# EAGLE schematic CHIRIMENBasicShield (EAGLE 7.5.0)
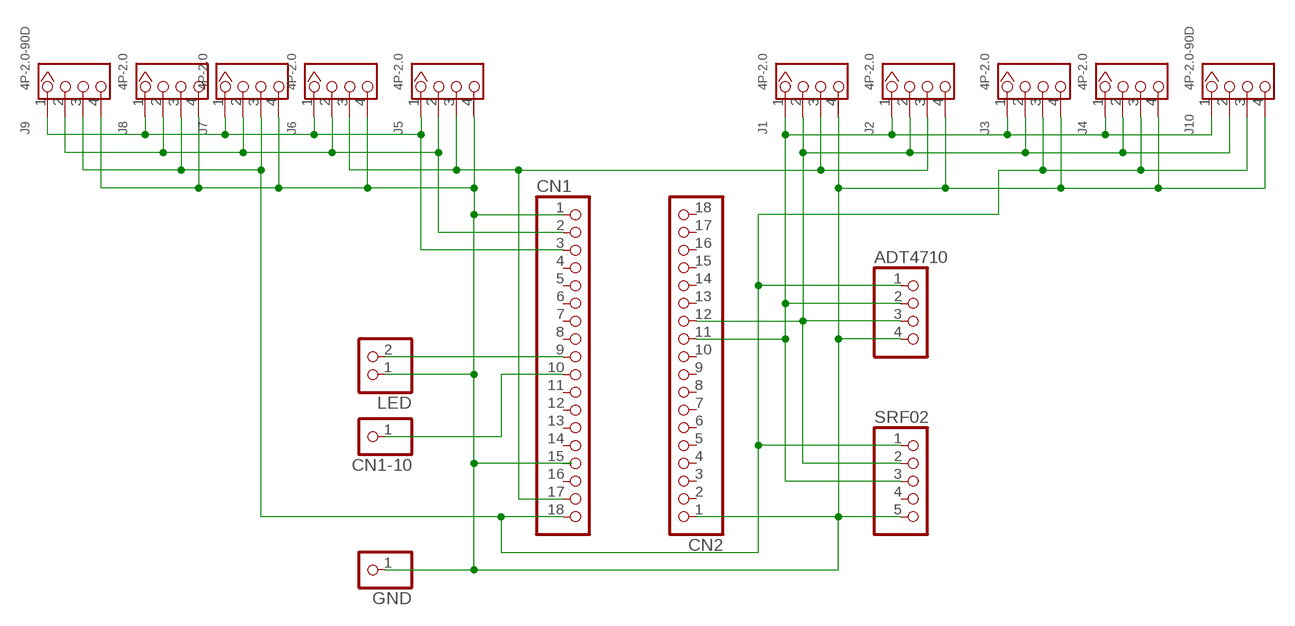
[diagram p0: schematic, sheet 1]

## Parts
ADT4710  PINHD-1X4  [1X04]
CN1  PINHD-1X18  [1X18]
CN1-10  PINHD-1X1  [1X01]
CN2  PINHD-1X18  [1X18]
GND  PINHD-1X1  [1X01]
J1  4P-2.0  GROVE-CONNECTOR-DIP(4P-2.0)  [HW4-2.0]
J2  4P-2.0  GROVE-CONNECTOR-DIP(4P-2.0)  [HW4-2.0]
J3  4P-2.0  GROVE-CONNECTOR-DIP(4P-2.0)  [HW4-2.0]
J4  4P-2.0  GROVE-CONNECTOR-DIP(4P-2.0)  [HW4-2.0]
J5  4P-2.0  GROVE-CONNECTOR-DIP(4P-2.0)  [HW4-2.0]
J6  4P-2.0  GROVE-CONNECTOR-DIP(4P-2.0)  [HW4-2.0]
J7  4P-2.0  GROVE-CONNECTOR-DIP(4P-2.0)  [HW4-2.0]
J8  4P-2.0  GROVE-CONNECTOR-DIP(4P-2.0)  [HW4-2.0]
J9  4P-2.0-90D  GROVE-CONNECTOR-DIP-90D(4P-2.0)  [HW4-2.0-90D]
J10  4P-2.0-90D  GROVE-CONNECTOR-DIP-90D(4P-2.0)  [HW4-2.0-90D]
LED  PINHD-1X2  [1X02]
SRF02  PINHD-1X5  [1X05]

## Nets
3V3 [Power]: CN1.17 J1.3 J2.3 J5.3 J6.3
5V [Power]: ADT4710.1 CN1.18 J3.3 J4.3 J7.3 J8.3 J9.3 J10.3 SRF02.1
GND [Power]: ADT4710.4 CN1.1 CN2.1 GND.1 J1.4 J2.4 J3.4 J4.4 J5.4 J6.4 J7.4 J8.4 J9.4 J10.4 LED.1 SRF02.5
N$1: CN1-10.1 CN1.10
N$2: CN1.2 J5.2 J6.2 J7.2 J8.2 J9.2
N$3: CN1.3 J5.1 J6.1 J7.1 J8.1 J9.1
N$6: ADT4710.3 CN2.12 J1.2 J2.2 J3.2 J4.2 J10.2 SRF02.2
N$7: ADT4710.2 CN2.11 J1.1 J2.1 J3.1 J4.1 J10.1 SRF02.3
N$9: CN1.9 LED.2
Unconnected: CN1.4 CN1.5 CN1.6 CN1.7 CN1.8 CN1.11 CN1.12 CN1.13 CN1.14 CN1.15 CN1.16 CN2.2 CN2.3 CN2.4 CN2.5 CN2.6 CN2.7 CN2.8 CN2.9 CN2.10 CN2.13 CN2.14 CN2.15 CN2.16 CN2.17 CN2.18 SRF02.4

## Library data of the parts
ADT4710 = pinhead:PINHD-1X4: PIN HEADER
CN1 CN2 = pinhead:PINHD-1X18: PIN HEADER
CN1-10 GND = pinhead:PINHD-1X1: PIN HEADER
J1-J8 = Seeed-Connector -2016:GROVE-CONNECTOR-DIP(4P-2.0): 320110033
J9 J10 = Seeed-OPL-Connector:GROVE-CONNECTOR-DIP-90D(4P-2.0): 320110034
LED = pinhead:PINHD-1X2: PIN HEADER
SRF02 = pinhead:PINHD-1X5: PIN HEADER

## Net classes
0 default: width 0.61 mm, clearance 0.508 mm
1 Power: width 0.914 mm, clearance 0.508 mm